# EAGLE design Bt_Drone (EAGLE 9.6.2)
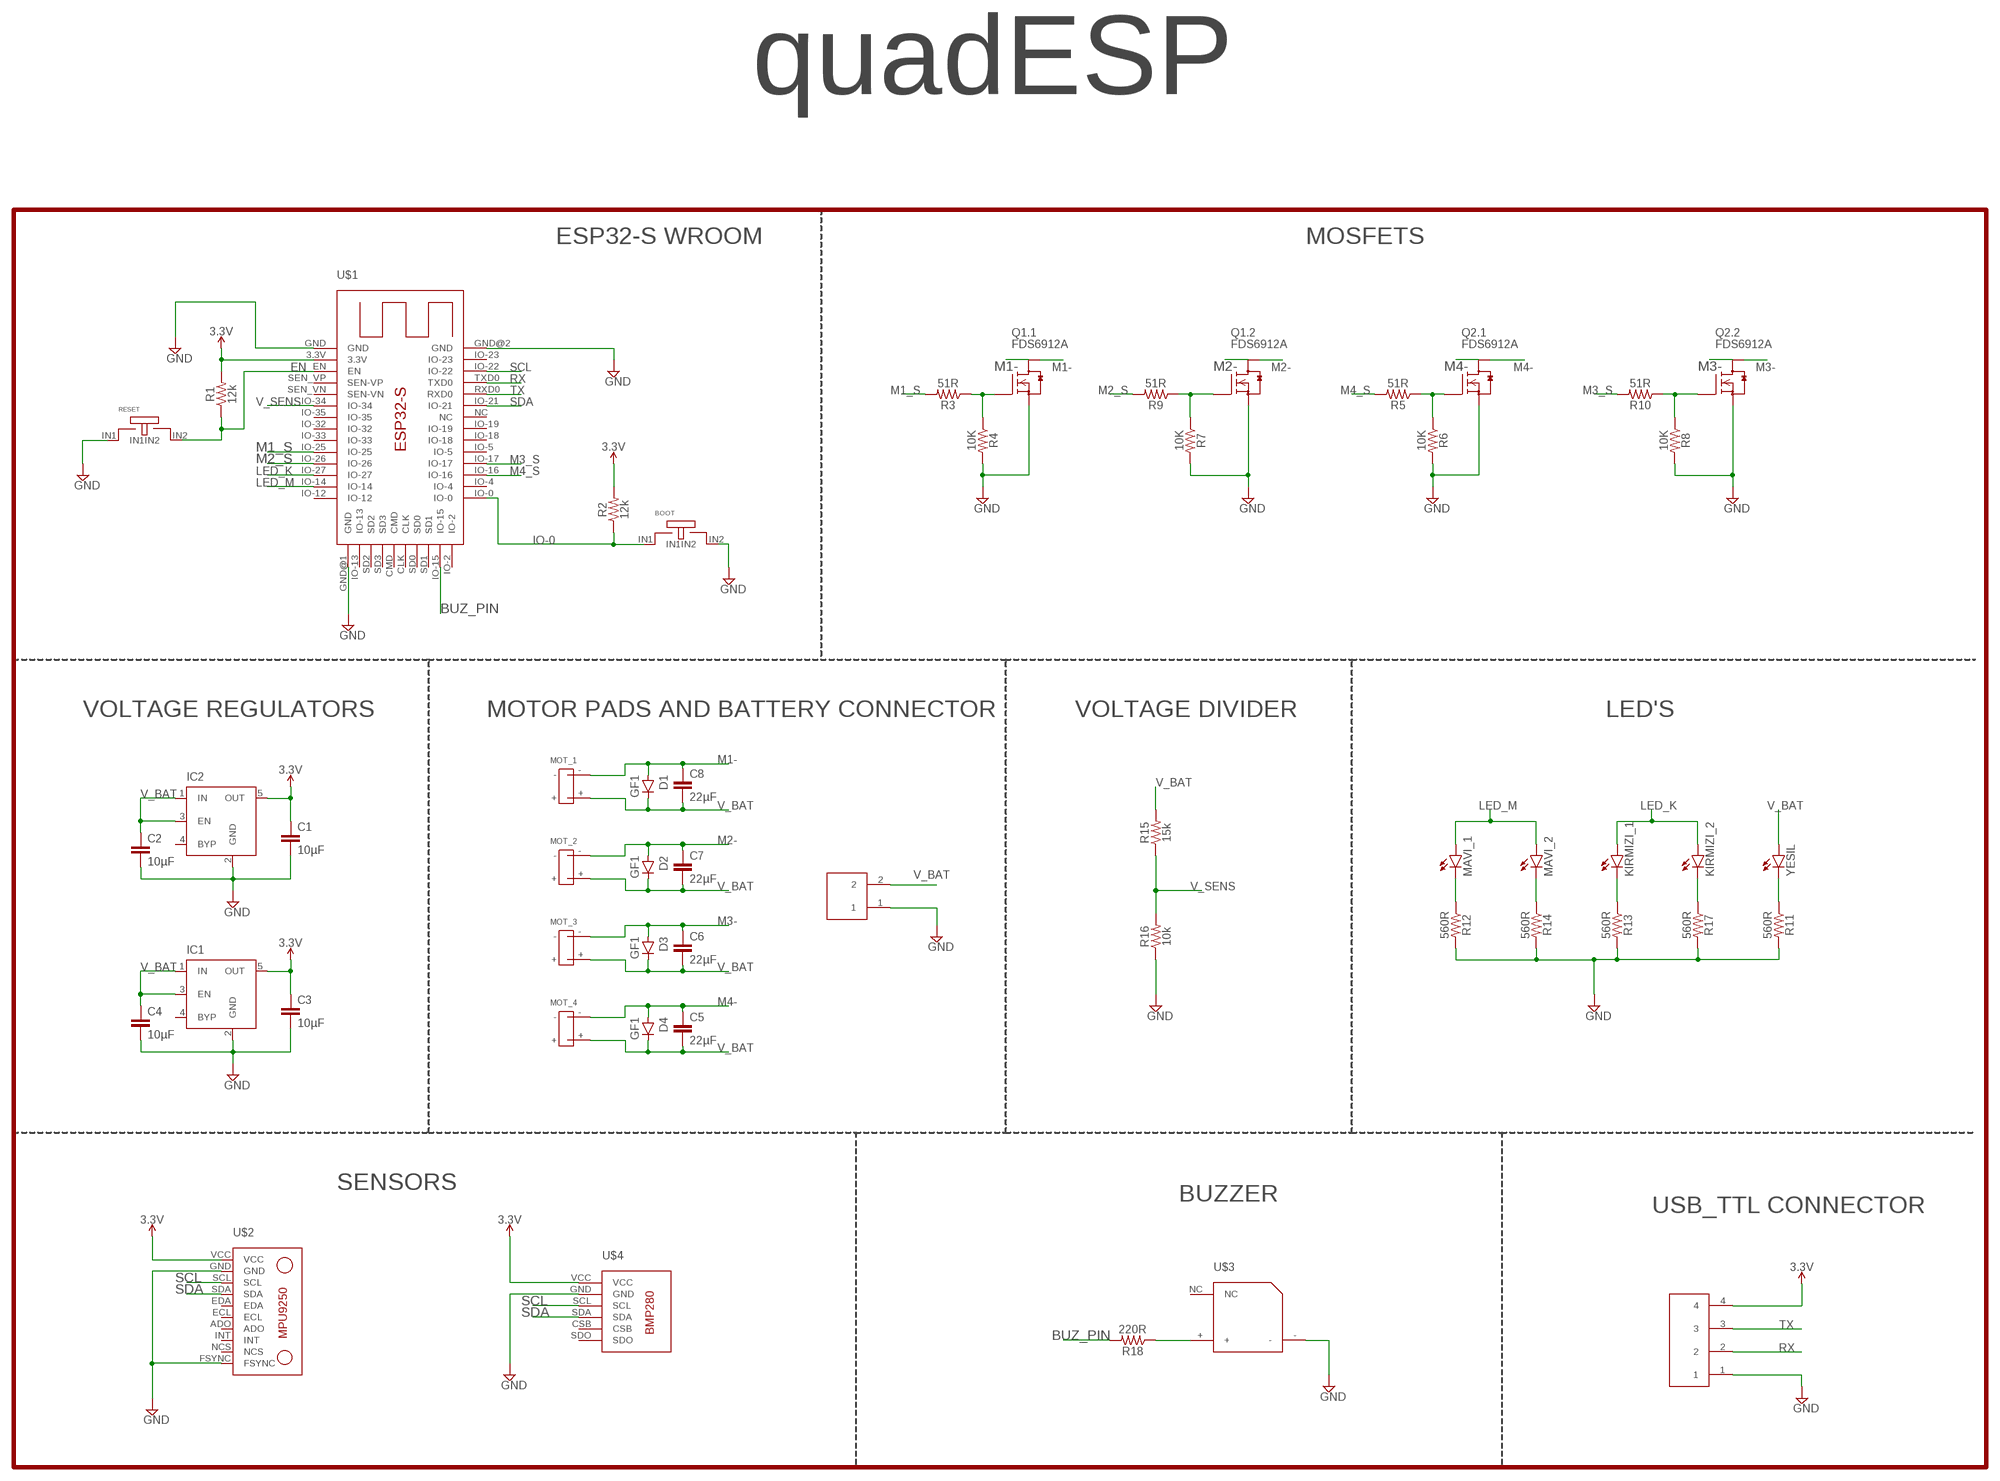
[diagram p0: schematic, sheet 1]

## Parts
BOOT  MINI_TIP_SMD_TACT_SWITCH_BUTON  [MINI_TIP_SMD_TACT_SWITCH_BUTON]
C1  10µF  0.33UF/330NF-0805-50V-10%  [0805]
C2  10µF  0.33UF/330NF-0805-50V-10%  [0805]
C3  10µF  0.33UF/330NF-0805-50V-10%  [0805]
C4  10µF  0.33UF/330NF-0805-50V-10%  [0805]
C5  22µF  0.33UF/330NF-0805-50V-10%  [0805]
C6  22µF  0.33UF/330NF-0805-50V-10%  [0805]
C7  22µF  0.33UF/330NF-0805-50V-10%  [0805]
C8  22µF  0.33UF/330NF-0805-50V-10%  [0805]
D1  GF1  [SMA-DO214AC]
D2  GF1  [SMA-DO214AC]
D3  GF1  [SMA-DO214AC]
D4  GF1  [SMA-DO214AC]
IC1  MIC5219XX  [SOT23-5]
IC2  MIC5219XX  [SOT23-5]
KIRMIZI_1  LEDCHIP-LED0805  [CHIP-LED0805]
KIRMIZI_2  LEDCHIP-LED0805  [CHIP-LED0805]
MAVI_1  LEDCHIP-LED0805  [CHIP-LED0805]
MAVI_2  LEDCHIP-LED0805  [CHIP-LED0805]
MOT_1  2X_SOLDER_PAD  [2X_SOLDER_PAD]
MOT_2  2X_SOLDER_PAD  [2X_SOLDER_PAD]
MOT_3  2X_SOLDER_PAD  [2X_SOLDER_PAD]
MOT_4  2X_SOLDER_PAD  [2X_SOLDER_PAD]
Q1  FDS6912A  [SO-8]
Q2  FDS6912A  [SO-8]
R1  12k  0.3OHM-0805-1/8W-1%  [0805]
R2  12k  0.3OHM-0805-1/8W-1%  [0805]
R3  51R  0.3OHM-0805-1/8W-1%  [0805]
R4  10K  0.3OHM-0805-1/8W-1%  [0805]
R5  51R  0.3OHM-0805-1/8W-1%  [0805]
R6  10K  0.3OHM-0805-1/8W-1%  [0805]
R7  10K  0.3OHM-0805-1/8W-1%  [0805]
R8  10K  0.3OHM-0805-1/8W-1%  [0805]
R9  51R  0.3OHM-0805-1/8W-1%  [0805]
R10  51R  0.3OHM-0805-1/8W-1%  [0805]
R11  560R  0.3OHM-0805-1/8W-1%  [0805]
R12  560R  0.3OHM-0805-1/8W-1%  [0805]
R13  560R  0.3OHM-0805-1/8W-1%  [0805]
R14  560R  0.3OHM-0805-1/8W-1%  [0805]
R15  15k  0.3OHM-0805-1/8W-1%  [0805]
R16  10k  0.3OHM-0805-1/8W-1%  [0805]
R17  560R  0.3OHM-0805-1/8W-1%  [0805]
R18  220R  0.3OHM-0805-1/8W-1%  [0805]
RESET  MINI_TIP_SMD_TACT_SWITCH_BUTON  [MINI_TIP_SMD_TACT_SWITCH_BUTON]
U$1  ESP32-S  [ESP32-S]
U$2  MPU9250  [MPU9250]
U$3  PASIVE_BUZZER_5MM_X_5MM_20MM  [PASIVE_BUZZER_5MM_X_5MM_20MM]
U$4  BMP280  [BMP280]
U$5  2_PIN_TUNIC  [2_PIN_TUNIC]
U$6  4_PIN_TUNIC  [4_PIN_TUNIC]
YESIL  LEDCHIP-LED0805  [CHIP-LED0805]

## Nets
3.3V: C1.1 C3.1 IC1.5(OUT) IC2.5(OUT) R1.2 R2.2 U$1.3.3V U$2.VCC U$4.VCC U$6.4
BUZ_PIN: R18.2 U$1.IO-15
EN: R1.1 RESET.IN2 U$1.EN
GND: BOOT.IN2 C1.2 C2.2 C3.2 C4.2 IC1.2(GND) IC2.2(GND) Q1.1(.2:S) Q1.3(.1:S) Q2.1(.2:S) Q2.3(.1:S) R4.2 R6.2 R7.2 R8.2 R11.2 R12.2 R13.2 R14.2 R16.1 R17.2 RESET.IN1 U$1.GND U$1.GND@1(GND) U$1.GND@2(GND) U$2.FSYNC U$2.GND U$3.- U$4.GND U$5.1 U$6.1
IO-0: BOOT.IN1 R2.1 U$1.IO-0
LED_K: KIRMIZI_1.A KIRMIZI_2.A U$1.IO-27
LED_M: MAVI_1.A MAVI_2.A U$1.IO-14
M1-: C8.1 D1.A MOT_1.- Q1.5(.1:D) Q1.6(.1:D)
M1_S: R3.2 U$1.IO-25
M2-: C7.1 D2.A MOT_2.- Q1.7(.2:D) Q1.8(.2:D)
M2_S: R9.2 U$1.IO-26
M3-: C6.1 D3.A MOT_3.- Q2.7(.2:D) Q2.8(.2:D)
M3_S: R10.2 U$1.IO-17
M4-: C5.1 D4.A MOT_4.- Q2.5(.1:D) Q2.6(.1:D)
M4_S: R5.2 U$1.IO-16
N$1: MAVI_2.C R14.1
N$2: KIRMIZI_1.C R13.1
N$3: KIRMIZI_2.C R17.1
N$4: R11.1 YESIL.C
N$5: MAVI_1.C R12.1
N$6: Q1.4(.1:G) R3.1 R4.1
N$7: Q1.2(.2:G) R7.1 R9.1
N$8: Q2.4(.1:G) R5.1 R6.1
N$9: Q2.2(.2:G) R8.1 R10.1
N$10: R18.1 U$3.+
RX: U$1.TXD0 U$6.2
SCL: U$1.IO-22 U$2.SCL U$4.SCL
SDA: U$1.IO-21 U$2.SDA U$4.SDA
TX: U$1.RXD0 U$6.3
V_BAT: C2.1 C4.1 C5.2 C6.2 C7.2 C8.2 D1.K(C) D2.K(C) D3.K(C) D4.K(C) IC1.1(IN) IC1.3(EN) IC2.1(IN) IC2.3(EN) MOT_1.+ MOT_2.+ MOT_3.+ MOT_4.+ R15.2 U$5.2 YESIL.A
V_SENS: R15.1 R16.2 U$1.IO-34
Unconnected: IC1.4(BYP) IC2.4(BYP) U$1.CLK U$1.CMD U$1.IO-2 U$1.IO-4 U$1.IO-5 U$1.IO-12 U$1.IO-13 U$1.IO-18 U$1.IO-19 U$1.IO-23 U$1.IO-32 U$1.IO-33 U$1.IO-35 U$1.NC U$1.SD0 U$1.SD1 U$1.SD2 U$1.SD3 U$1.SEN_VN(SEN-VN) U$1.SEN_VP(SEN-VP) U$2.ADO U$2.ECL U$2.EDA U$2.INT U$2.NCS U$3.NC U$4.CSB U$4.SDO

## Notes on the sheet
- quadESP
- ESP32-S WROOM | MOSFETS
- VOLTAGE REGULATORS | MOTOR PADS AND BATTERY CONNECTOR | VOLTAGE DIVIDER | LED'S
- SENSORS
- BUZZER
- USB_TTL CONNECTOR

## Library data of the parts
BOOT RESET = Tactile Switch 2 pin 6mm X 3mm:MINI_TIP_SMD_TACT_SWITCH_BUTON: 6 X 3mm smd switch
C1-C8 = SparkFun-Capacitors:0.33UF/330NF: 0.33µF/330nF ceramic capacitors A capacitor is a passive two-terminal electrical component used to store electrical energy temporarily in an electric field.; PROD_ID: CAP-08469; VALUE: 0.33µF
D1-D4 = diode:GF1: DIODE
IC1 IC2 = v-reg-micrel:MIC5219XX: VOLTAGE REGULATOR; OC_FARNELL: unknown; OC_NEWARK: unknown
KIRMIZI_1 KIRMIZI_2 MAVI_1 MAVI_2 YESIL = led:LED: LED OSRAM: - CHIPLED LG R971, LG N971, LY N971, LG Q971, LY Q971, LO R971, LY R971 LH N974, LH R974 LS Q976, LO Q976, LY Q976 LO Q996 - Hyper CHIPLED LW Q18S LB Q993, LB Q99A, LB R99A - SideLED LS A670, LO A670, LY A670, LG A670, LP A670 LB A673, LV A673, LT A673, LW A673 LH A674 LY A675 LS A676, LA A676, LO A676, LY A676, LW A676 LS A679, LY A679, LG A679 - Hyper Micro SIDELED® LS Y876, LA Y876, LO Y876, LY Y876 LT Y87S - SmartLED LW L88C, LW L88S LB L89C, LB L89S, LG L890 LS L89K, LO L89K, LY L89K LS L896, LA L896, LO L896, LY L896 - TOPLED LS T670, LO T670, LY T670, LG T670, LP T670 LSG T670, LSP T670, LSY T670, LOP T670, LYG T670 LG T671, LOG T671, LSG T671 LB T673, LV T673, LT T673, LW T673 LH T674 LS T676, LA T676, LO T676, LY T676, LB T676, LH T676, LSB T676, LW T676 LB T67C, LV T67C, LT T67C, LS T67K, LO T67K, LY T67K, LW E67C LS E67B, LA E67B, LO E67B, LY E67B, LB E67C, LV E67C, LT E67C LW T67C LS T679, LY T679, LG T679 LS T770, LO T770, LY T770, LG T770, LP T770 LB T773, LV T773, LT T773, LW T773 LH T774 LS E675, LA E675, LY E675, LS T675 LS T776, LA T776, LO T776, LY T776, LB T776 LHGB T686 LT T68C, LB T68C - Hyper Mini TOPLED® LB M676 - Mini TOPLED Santana® LG M470 LS M47K, LO M47K, LY M47K Source: http://www.osram.convergy.de LUXEON: - LUMILED® LXK2-PW12-R00, LXK2-PW12-S00, LXK2-PW14-U00, LXK2-PW14-V00 LXK2-PM12-R00, LXK2-PM12-S00, LXK2-PM14-U00 LXK2-PE12-Q00, LXK2-PE12-R00, LXK2-PE12-S00, LXK2-PE14-T00, LXK2-PE14-U00 LXK2-PB12-K00, LXK2-PB12-L00, LXK2-PB12-M00, LXK2-PB14-N00, LXK2-PB14-P00, LXK2-PB14-Q00 LXK2-PR12-L00, LXK2-PR12-M00, LXK2-PR14-Q00, LXK2-PR14-R00 LXK2-PD12-Q00, LXK2-PD12-R00, LXK2-PD12-S00 LXK2-PH12-R00, LXK2-PH12-S00 LXK2-PL12-P00, LXK2-PL12-Q00, LXK2-PL12-R00 Source: www.luxeon.com KINGBRIGHT: KA-3528ASYC Source: www.kingbright.com
MOT_1-MOT_4 = 2 X 3mm_round_solder_pads:2X_SOLDER_PAD
Q1 Q2 = m-pad-2.1:FDS6912A: Fairchild's FDS6912A Dual N-Channel Logic Level PowerTrench MOSFET General Description: These N-Channel Logic Level MOSFETs are produced using Fairchild Semiconductor's advanced PowerTrench process that has been especially tailored to minimize the on-state resistance and yet maintain superior switching performance. These devices are well suited for low voltage and battery powered applications where low in-line power loss and fast switching are required. Features: 6 A, 30 V. RDS(ON) = 28 mOhm @ VGS = 10 V RDS(ON) = 35 mOhm @ VGS = 4.5 V Fast switching speed Low gate charge High performance trench technology for extremely low RDS(ON) High power and current handling capability Please send any comments to: messi@users.sourceforge.net
R1-R18 = SparkFun-Resistors:0.3OHM: 0.3Ω resistor A resistor is a passive two-terminal electrical component that implements electrical resistance as a circuit element. Resistors act to reduce current flow, and, at the same time, act to lower voltage levels within circuits. - Wikipedia; PROD_ID: RES-11622; VALUE: 0.3
U$1 = ESP32-S:ESP32-S: ESP32-S WIFI/BLUETOOTH MICRO CONTROLLER IC size 18mm x 25.5mm pad size 1.5mm x 0.9mm
U$2 = MPU9250:MPU9250: MPU9250 9 DOF accelometer gyro compass sensor 15mm X 25mm
U$3 = PASIVE_BUZZER_5MM_X_5MM_20MM:PASIVE_BUZZER_5MM_X_5MM_20MM: PASIVE_BUZZER_5MM_X_5MM_20MM
U$4 = BMP280:BMP280: BMP280 Pressure sensor 11.5mm x 15mm
U$5 = Tunic_Connector:2_PIN_TUNIC
U$6 = Tunic_Connector:4_PIN_TUNIC

## Board
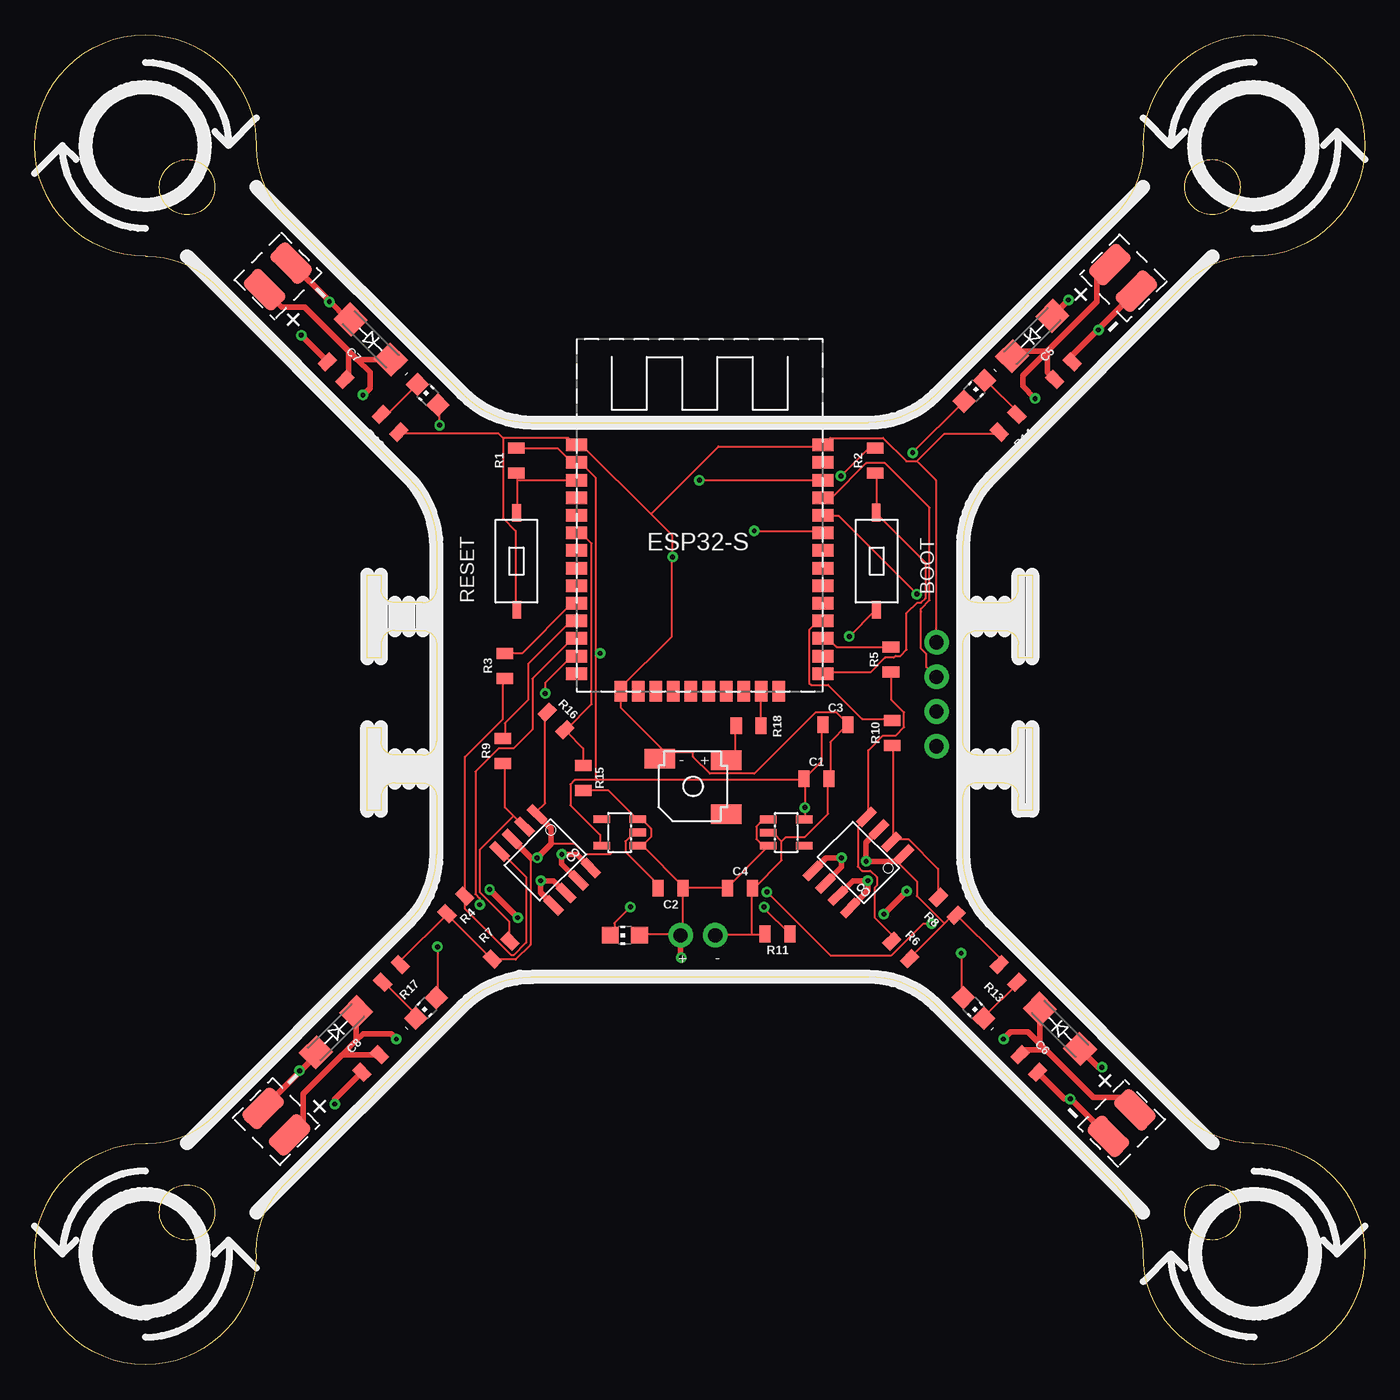
[diagram p1: board, top side]
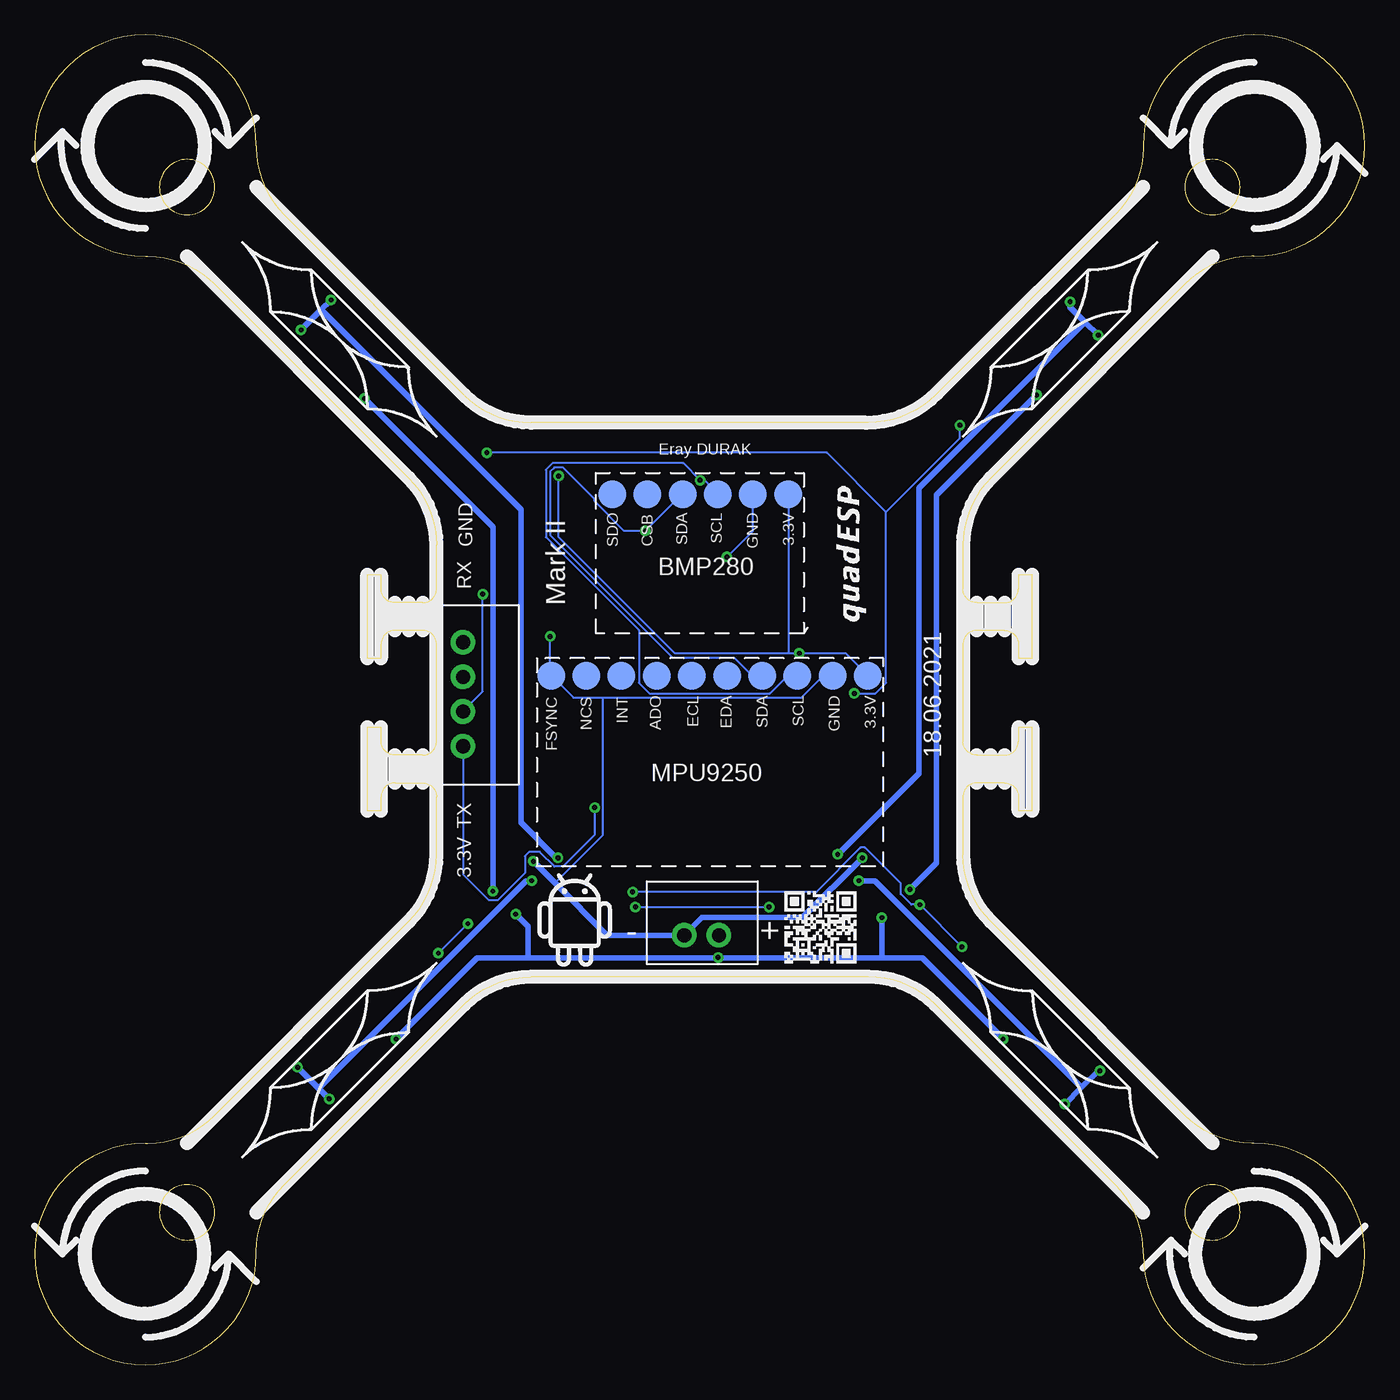
[diagram p2: board, bottom side, seen from below]

Size 96 x 96 mm. Coordinates in mm from the lower left corner, seen from the top.
Outline: 35.83,28 60.17,28 arc-45 65,26 78,13 arc-45 80,8.17 80,8 arc90 88,0 arc180 88,16 87.83,16 arc-45 83,18 69,32 arc-45 67,36.83 67,41 arc-90 68,42 70,42 arc-90 71,41 71,40 72,40 72,46 71,46 71,45 arc-90 70,44 68,44 arc-90 67,45 67,52 arc-90 68,53 70,53 arc-90 71,52 71,51 72,51 72,57 71,57 71,56 arc-90 70,55 68,55 arc-90 67,56 67,59.17 arc-45 69,64 83,78 arc-45 87.83,80 88,80 arc180 88,96 arc90 80,88 80,87.83 arc-45 78,83 65,70 arc-45 60.17,68 35.83,68 arc-45 31,70 18,83 arc-45 16,87.83 16,88 arc90 8,96 arc180 8,80 8.17,80 arc-45 13,78 27,64 arc-45 29,59.17 29,56 arc-90 28,55 26,55 arc-90 25,56 25,57 24,57 24,51 25,51 25,52 arc-90 26,53 28,53 arc-90 29,52 29,45 arc-90 28,44 26,44 arc-90 25,45 25,46 24,46 24,40 25,40 25,41 arc-90 26,42 28,42 arc-90 29,41 29,36.83 arc-45 27,32 13,18 arc-45 8.17,16 8,16 arc180 8,0 arc90 16,8 16,8.17 arc-45 18,13 31,26 arc-45 35.83,28
Outline: 83,85 arc-180 87,85 arc-180 83,85
Outline: 83,11 arc-180 87,11 arc-180 83,11
Outline: 9,11 arc-180 13,11 arc-180 9,11
Outline: 9,85 arc-180 13,85 arc-180 9,85
Copper layers (1*16): Top 0.035mm / dielectric 1.5mm / Bottom 0.035mm
Design rules "default": minimum track width 6mil, minimum drill 0.35mm, track to track 6mil, track to pad 6mil, pad to pad 6mil, via to via 6mil, smd to smd 6mil, copper to edge 40mil, drill to drill 6mil, minimum pad ring 10mil, minimum via ring 8mil, stop-mask expansion 4mil, vias tented up to drill 0mil, thermal gap 10mil
Holes 8.5 mm at 8,88 88,88 88,8 8,8

### Footprints (pad centres in the part's own frame; a part is rotated, then mirrored left to right if it is on the bottom)
MINI_TIP_SMD_TACT_SWITCH_BUTON = smd 1.27 x 0.635: IN1 -3.51,-0.53; IN2 3.5,-0.51
0805 = smd 0.8 x 1.2: 1 -0.9,0; 2 0.9,0
SMA-DO214AC = smd 1.8 x 1.7: A -2.05,0; K 2.05,0
SOT23-5 = smd 0.55 x 1.2: 1 -0.95,-1.3; 2 0,-1.3; 3 0.95,-1.3; 4 0.95,1.3; 5 -0.95,1.3
CHIP-LED0805 = smd 1.2 x 1.2: A 0,-1.05; C 0,1.05
2X_SOLDER_PAD = smd 3 x 1.7: + 0,-2; - 0,0.73
SO-8 = smd 1.524 x 0.61: 1 -2.743,1.27; 2 -2.743,0; 3 -2.743,-1.27; 4 -2.743,-2.54; 5 2.743,-2.54; 6 2.743,-1.27; 7 2.743,0; 8 2.743,1.27
ESP32-S = smd 1.5 x 0.9: 3.3V -8.89,7.62; EN -8.89,6.35; GND -8.89,8.89; GND@2 8.89,8.89; IO-0 8.89,-7.62; IO-4 8.89,-6.35; IO-5 8.89,-2.54; IO-12 -8.89,-7.62; IO-14 -8.89,-6.35; IO-16 8.89,-5.08; IO-17 8.89,-3.81; IO-18 8.89,-1.27; IO-19 8.89,0; IO-21 8.89,2.54; IO-22 8.89,6.35; IO-23 8.89,7.62; IO-25 -8.89,-2.54; IO-26 -8.89,-3.81; IO-27 -8.89,-5.08; IO-32 -8.89,0; IO-33 -8.89,-1.27; IO-34 -8.89,2.54; IO-35 -8.89,1.27; NC 8.89,1.27; RXD0 8.89,3.81; SEN_VN -8.89,3.81; SEN_VP -8.89,5.08; TXD0 8.89,5.08 | smd 0.9 x 1.5: CLK 0.635,-8.89; CMD -0.635,-8.89; GND@1 -5.715,-8.89; IO-2 5.715,-8.89; IO-13 -4.445,-8.89; IO-15 4.445,-8.89; SD0 1.905,-8.89; SD1 3.175,-8.89; SD2 -3.175,-8.89; SD3 -1.905,-8.89
MPU9250 = smd 2.032 x 2.032: ADO 1.27,8.89; ECL 1.27,11.43; EDA 1.27,13.97; FSYNC 1.27,1.27; GND 1.27,21.59; INT 1.27,6.35; NCS 1.27,3.81; SCL 1.27,19.05; SDA 1.27,16.51; VCC 1.27,24.13
PASIVE_BUZZER_5MM_X_5MM_20MM = smd 2.2 x 1.4: + -2.4,-1.9; - 2.4,-2; NC -2.4,2
BMP280 = smd 2.032 x 2.032: CSB -5.08,-2.54; GND -5.08,5.08; SCL -5.08,2.54; SDA -5.08,0; SDO -5.08,-5.08; VCC -5.08,7.62
2_PIN_TUNIC = drill 1.02 pad 1.778: 1 -1.3,0; 2 1.2,0
4_PIN_TUNIC = drill 1.02 pad 1.778: 1 -4,0; 2 -1.5,0; 3 1,0; 4 3.5,0

### Placement (x,y rotation side)
BOOT  61.27,58 270 top
C1  56.41,42.3 0 top
C2  45.9,34.4 180 top
C3  57.79,46.2 0 top
C4  50.9,34.4 0 top
C5  74.25,71.75 225 top
C6  71.75,21.75 135 top
C7  21.75,71.75 315 top
C8  24.25,21.75 45 top
D1  21.75,24 45 top
D2  24.25,74 315 top
D3  74,24.25 135 top
D4  72,74.25 225 top
IC1  54.24,38.41 270 top
IC2  42.22,38.42 90 top
KIRMIZI_1  67.76,25.76 225 top
KIRMIZI_2  28.24,25.76 135 top
MAVI_1  28.37,70.02 45 top
MAVI_2  67.82,70.29 315 top
MOT_1  17,18 45 top
MOT_2  18,79 315 top
MOT_3  78,17 135 top
MOT_4  79,78 225 top
Q1  37.3,36.9 315 top
Q2  59.9,35.8 225 top
R1  34.75,65.25 90 top
R2  60.65,65.25 90 top
R3  33.93,50.44 90 top
R4  30.4,33.2 225 top
R5  61.8,50.9 90 top
R6  62.5,29.94 315 top
R7  33.67,29.93 225 top
R8  65.86,33.1 315 top
R9  33.8,44.3 90 top
R10  61.9,45.6 90 top
R11  53.6,31.1 180 top
R12  25.65,67.95 315 top
R13  70.25,28.25 135 top
R14  70.25,67.95 225 top
R15  39.6,42.36 270 top
R16  37.63,46.47 315 top
R17  25.75,28.25 45 top
R18  51.53,46.13 0 top
RESET  34.27,58 90 top
U$1  48,57.5 0 top
U$2  60,51 270 bottom
U$3  47.52,41.75 180 top
U$4  49.24,57.75 270 bottom
U$5  47.82,31.01 180 top
U$6  65.09,48.15 270 top
YESIL  42.6,31 90 top

### Tracks (layer width: path | path; a pad name or v marks a point on that pad's centre or on a via)
3.3V  (via drill 0.35)
  Top 0.152: v58.18,64.15 60.16,66.13 60.62,66.13 R2.2 | R1.2 34.86,66.13 37.76,66.13 38.67,65.22 38.98,65.22 U$1.3.3V 39.13,65.07 39.44,65.07 40.5,64 40.5,51.35 | 40.5,42.21 55.44,42.21 C1.1 | 40.5,42.21 38.98,42.21 38.67,41.9 38.67,40.38 40.81,38.24 40.81,37.48 IC2.5 | IC1.5 55.59,39.46 v55.59,40.23 55.59,42.21 C1.1 | C3.1 56.81,46.17 56.81,43.58 55.59,42.36 C1.1 | 40.5,42.21 40.5,51.35 | 40.5,51.35 v40.81,51.35
  Bottom 0.152: v58.18,64.15 58.18,59.73 49.8,51.35 41.57,51.35 | 41.57,51.35 v40.81,51.35 37.45,51.35 35.93,49.83 U$2.VCC | 41.57,51.35 41.57,62.78 U$4.VCC | v55.59,40.23 55.59,38.24 57.88,35.96 58.49,35.96 59.55,37.02 60.31,37.02 60.62,36.72 60.62,35.5 62.6,33.52 63.21,33.52 65.04,35.35 65.04,44.65 U$6.4
BUZ_PIN
  Top 0.152: R18.2 52.39,46.17 52.39,48.61 U$1.IO-15
EN
  Top 0.152: 34.86,63.85 34.86,61.56 RESET.IN2 | 34.86,63.85 34.86,64.3 R1.1 | 34.86,63.85 38.98,63.85 U$1.EN
GND  (via drill 0.35)
  Top 0.152: 63.67,65.22 65.65,67.2 69.61,67.2 R14.2 | 63.67,65.22 62.91,65.22 61.23,66.89 57.42,66.89 56.96,66.44 U$1.GND@2 56.81,66.29 49.34,66.29 44.47,61.41 | 63.67,65.22 65.04,63.85 65.04,52.27 U$6.1 | 33.8,66.89 33.49,67.2 26.33,67.2 R12.2 | 33.8,66.89 38.52,66.89 38.98,66.44 U$1.GND 39.13,66.29 39.59,66.29 44.47,61.41 | 33.8,66.89 33.8,61.1 34.71,60.19 34.71,54.55 RESET.IN1 | 44.47,61.41 45.99,59.89 45.99,58.36 v46.04,58.31 45.99,58.21 45.99,52.57 42.18,48.76 U$1.GND@1 42.33,48.61 42.33,47.39 45.53,44.19 U$3.- 45.58,44.21 47.44,44.21 47.51,44.19 47.51,43.88 48.73,42.66 51.93,42.66 56.35,47.08 57.88,47.08 58.64,46.32 C3.2 58.64,46.17 57.42,44.95 57.42,42.36 C1.2 57.27,42.21 57.27,39.77 55.59,38.09 54.22,38.09 53.91,37.79 | v58.79,52.57 60.62,54.4 BOOT.IN2 | R17.2 26.48,28.95 26.48,29.25 29.68,32.45 R4.2 29.84,32.45 32.88,29.41 R7.2 33.03,29.25 34.71,29.25 35.78,30.32 35.78,36.41 35.81,36.59 | 65.65,31.84 66.41,32.6 R8.2 66.56,32.45 69.61,29.41 69.61,28.95 R13.2 | 65.65,31.84 63.21,29.41 R6.2 | 42.64,37.02 44.92,34.74 44.92,34.43 C2.2 | 42.64,37.02 42.64,37.79 43.4,38.55 IC2.2 | R16.1 36.84,47.08 36.84,40.53 36.24,39.92 Q1.1 | 51.78,31.08 49.19,31.08 U$5.1 | 51.78,31.08 52.69,31.08 R11.2 | 51.78,31.08 51.78,34.28 C4.2 51.93,34.43 53.91,36.41 53.91,37.79 | 53.91,37.79 53.3,38.4 53,38.4 IC1.2 | 42.64,37.02 41.72,37.02 41.57,36.87 39.74,36.87 38.98,37.63 37.45,37.63 37.28,37.61 | 65.65,31.84 63.67,33.82 63.67,34.89 62.3,36.26 Q2.1
  Top 0.406: Q2.1 62.23,36.34 v60.01,36.34 60.01,37.71 Q2.3 | Q1.3 35.81,36.59 v36.26,36.59 37.28,37.61 37.28,38.72 Q1.1
  Bottom 0.152: v46.04,58.31 44.16,60.19 U$4.GND | v58.79,52.57 58.79,49.83 U$2.FSYNC 58.64,49.67 57.11,48.15 54.98,48.15 | 54.98,48.15 40.66,48.15 39.13,49.67 38.52,49.67 U$2.GND | 54.98,48.15 54.98,38.24 58.45,34.78
  Bottom 0.406: v60.01,36.34 58.45,34.78 54.68,31.01 U$5.1 47.85,32.27 40.58,32.27 v36.26,36.59
IO-0
  Top 0.152: R2.1 60.77,64.3 60.77,61.56 BOOT.IN1 60.77,61.41 64.28,57.9 64.28,55.31 63.97,55.01 63.69,55.01 62.93,54.25 62.93,51.61 62.5,51.17 62.13,51.17 62,51.05 61.38,51.05 60.31,49.98 56.96,49.98 U$1.IO-0
LED_K  (via drill 0.35)
  Top 0.152: v29.07,30.17 29.07,26.51 KIRMIZI_2.A | v32.12,33.22 32.12,33.67 31.82,33.98 31.82,42.82 33.49,44.49 34.56,44.49 35.93,45.86 35.93,49.52 38.98,52.57 U$1.IO-27 | v66.87,29.71 66.87,26.51 KIRMIZI_1.A | v64.73,31.84 64.12,31.84 61.84,29.56 57.42,29.56 v52.85,34.13
  Bottom 0.152: v29.07,30.17 v32.12,33.22 32.73,33.22 33.49,33.98 33.49,34.74 36.08,37.33 36.39,37.33 39.59,34.13 v52.85,34.13 | v64.73,31.84 v66.87,29.71
LED_M  (via drill 0.35)
  Top 0.152: v29.23,67.81 29.23,69.18 MAVI_1.A | v36.84,48.45 36.84,49.22 38.67,51.05 38.98,51.05 U$1.IO-14 | v63.36,65.83 67.02,69.49 MAVI_2.A
  Bottom 0.152: v29.23,67.81 29.23,66.89 34.56,61.56 | 34.56,61.56 34.56,49.22 35.32,48.45 v36.84,48.45 | v63.36,65.83 38.83,65.83 34.56,61.56
M1-  (via drill 0.35)
  Top 0.406: MOT_1.- 19.12,21.15 | 19.12,21.15 v19.12,21.23 | v21.66,18.81 21.66,19.16 C8.1 | Q1.5 36.52,34.09 v36.52,34.94 37.46,34.94 Q1.6 | D1.A 20.3,22.33 19.12,21.15
  Bottom 0.406: v19.12,21.23 19.24,21.23 20.45,20.02 | 20.45,20.02 v21.66,18.81 | 20.45,20.02 35.37,34.94 v36.52,34.94
M1_S
  Top 0.152: R3.2 33.95,51.35 35.17,51.35 38.67,54.86 38.98,54.86 U$1.IO-25
M2-  (via drill 0.35)
  Top 0.406: MOT_2.- 21.27,76.76 | 21.27,76.76 v21.27,76.72 | v19.24,74.31 21.11,72.44 C7.1 | D2.A 22.58,75.45 21.27,76.76 | Q1.7 38.04,36.16 v38.04,36.85 39.15,36.85 Q1.8
  Bottom 0.406: v21.27,76.72 21.27,76.34 20.2,75.26 | 20.2,75.26 v19.24,74.31 | 20.2,75.26 32.2,63.26 32.2,42.69 v38.04,36.85
M2_S
  Top 0.152: R9.2 33.95,45.25 33.95,46.32 35.63,48 35.63,50.59 38.67,53.64 38.98,53.64 U$1.IO-26
M3-  (via drill 0.35)
  Top 0.406: MOT_3.- 74.77,19.19 v74.74,19.19 74.31,19.19 C6.1 | v77.03,21.48 76.77,21.48 D3.A | Q2.8 60.14,34.24 v60.14,34.94 59.04,34.94 Q2.7
  Bottom 0.406: v74.74,19.19 75.5,19.96 | 75.5,19.96 v77.03,21.48 | 75.5,19.96 60.52,34.94 v60.14,34.94
M3_S
  Top 0.152: R10.2 61.84,46.63 59.7,46.63 57.27,49.06 56.05,49.06 55.89,49.22 55.89,53.03 56.5,53.64 56.81,53.64 U$1.IO-17
M4-  (via drill 0.35)
  Top 0.406: MOT_4.- 76.77,74.74 | 76.77,74.74 v76.77,74.69 | v74.61,76.85 73.46,75.7 D4.A | C5.1 74.89,72.85 76.77,74.74 | Q2.6 58.23,35.93 v58.23,36.59 57.1,36.59 Q2.5
  Bottom 0.406: v76.77,74.69 75.31,76.15 | 75.31,76.15 v74.61,76.85 | 75.31,76.15 60.9,61.74 60.9,39.13 58.36,36.59 v58.23,36.59
M4_S
  Top 0.152: R5.2 61.69,51.81 57.88,51.81 57.27,52.42 56.96,52.42 U$1.IO-16
N$1
  Top 0.152: MAVI_2.C 68.7,71.01 70.98,68.72 R14.1
N$2
  Top 0.152: KIRMIZI_1.C 68.54,25.14 70.98,27.58 R13.1
N$3
  Top 0.152: KIRMIZI_2.C 27.4,25.14 27.4,25.44 25.26,27.58 R17.1
N$4  (via drill 0.35)
  Top 0.152: YESIL.C 41.57,30.93 41.85,30.93 41.85,31.89 v42.99,33.04 | R11.1 52.64,32.96 v52.64,33.04
  Bottom 0.152: v52.64,33.04 v42.99,33.04
N$5
  Top 0.152: R12.1 25.11,68.72 25.57,68.72 27.55,70.7 MAVI_1.C
N$6
  Top 0.152: Q1.4 33.65,37.02 35.47,35.2 35.47,30.47 34.56,29.56 34.41,29.56 31.05,32.91 31.05,33.82 R4.1 31.05,33.98 31.05,43.88 33.8,46.63 33.8,49.52 R3.1
N$7
  Top 0.152: 34.56,39.62 35.32,38.85 Q1.2 | 34.56,39.62 33.95,40.23 33.95,43.27 R9.1 | 34.56,39.62 32.12,37.18 32.12,34.13 34.25,32 34.25,30.62 R7.1
N$8
  Top 0.152: R5.1 61.84,49.98 61.84,48 62.75,47.08 62.75,46.02 62.14,45.41 61.23,45.41 60.16,44.34 60.16,39.62 Q2.4 60.01,39.46 59.4,38.85 59.4,35.96 59.7,35.65 60.31,35.65 60.77,35.2 60.77,34.59 60.62,34.43 60.62,32.3 61.84,31.08 61.84,30.62 R6.1
N$9
  Top 0.152: 61.99,37.94 61.99,37.79 Q2.2 61.99,37.94 | 61.99,37.94 61.99,44.65 R10.1 | 61.99,37.94 63.06,37.94 65.19,35.81 65.19,33.82 R8.1
N$10
  Top 0.152: R18.1 50.56,46.02 50.56,44.34 49.95,43.73 U$3.+
RX
  Top 0.152: U$1.TXD0 56.96,62.63 57.57,62.63 60.01,65.07 61.38,65.07 64.58,61.87 64.58,55.19 63.95,54.55 63.95,54.37 63.97,54.35 63.97,51.69 64.36,51.3 64.36,50.36 65.04,49.67 U$6.2
SCL  (via drill 0.35)
  Top 0.152: v47.97,63.85 56.81,63.85 U$1.IO-22
  Bottom 0.152: U$4.SCL 46.75,62.93 47.67,63.85 v47.97,63.85 49.19,65.07 58.64,65.07 59.1,64.61 59.1,59.73 52.39,53.03 52.39,49.22 51.63,48.45 42.94,48.45 41.72,49.67 40.96,49.67 U$2.SCL
SDA  (via drill 0.35)
  Top 0.152: v51.93,60.19 56.81,60.19 U$1.IO-21
  Bottom 0.152: U$4.SDA 49.34,62.78 v51.93,60.19 53.46,60.19 55.59,62.32 55.59,62.48 57.88,64.76 58.49,64.76 58.79,64.46 58.79,59.89 49.95,51.05 45.53,51.05 44.31,49.83 43.55,49.83 U$2.SDA
TX  (via drill 0.35)
  Top 0.152: v63.67,55.62 58.03,61.26 56.96,61.26 U$1.RXD0
  Bottom 0.152: v63.67,55.62 63.67,48.61 65.04,47.24 U$6.3
V_BAT  (via drill 0.35)
  Top 0.152: 43.86,37.48 43.55,37.48 IC2.1 43.86,37.48 | 43.86,37.48 44.47,38.09 44.47,38.7 43.86,39.31 43.55,39.31 IC2.3 43.4,39.46 41.42,41.44 39.74,41.44 R15.2 | YESIL.A 43.7,31.08 46.45,31.08 U$5.2 46.75,31.08 46.75,34.28 C2.1 46.9,34.43 | IC1.1 52.85,39.31 52.54,39.31 52.08,38.85 52.08,37.94 52.54,37.48 52.85,37.48 IC1.3 52.85,37.33 49.95,34.43 | 49.95,34.43 46.9,34.43 | 49.95,34.43 C4.1 | 46.9,34.43 43.86,37.48
  Top 0.406: MOT_1.+ 19.37,17.54 19.37,19.57 22.18,22.39 | 22.18,22.39 C8.2 | D1.K 23.2,23.41 | 22.18,22.39 23.2,23.41 | 23.2,23.41 23.69,23.89 25.72,23.89 v26.1,23.51 | MOT_3.+ 78.51,19.32 76.39,19.32 72.96,22.75 | 72.96,22.75 71.48,22.75 C6.2 | D3.K 72.55,23.16 | 72.55,23.16 72.96,22.75 | 72.55,23.16 71.69,24.02 70.42,24.02 v69.92,23.51 | MOT_2.+ 17.83,76.34 19.5,76.34 22.67,73.17 | 22.67,73.17 22.67,71.4 C7.2 | D2.K 23.29,72.55 | 23.29,72.55 22.67,73.17 | 23.29,72.55 24.2,71.64 24.2,70.5 v23.69,69.99 | MOT_4.+ 76.65,78.47 76.65,76.72 73.09,73.17 | 73.09,73.17 73.09,71.64 C5.2 | D4.K 70.92,73.17 73.09,73.17 | 73.09,73.17 71.31,71.39 71.31,70.63 v72.2,69.74 | v62.93,34.18 v61.28,32.53 | v32.83,34.31 v34.86,32.27 | U$5.2 46.62,29.45 v46.67,29.39
  Bottom 0.406: v26.1,23.51 31.94,29.35 34.86,29.35 | 34.86,29.35 46.67,29.35 | 46.67,29.35 v46.67,29.39 | v69.92,23.51 64.07,29.35 60.39,29.35 | 60.39,29.35 46.67,29.35 | v72.2,69.74 62.93,60.47 v62.93,34.18 | v61.28,32.53 60.39,31.64 60.39,29.35 | v23.69,69.99 30.93,62.75 30.93,36.21 v32.83,34.31 | v34.86,32.27 34.86,29.35
V_SENS
  Top 0.152: R15.1 39.59,43.27 39.59,44.49 38.37,45.71 R16.2 38.37,45.86 40.2,47.69 40.2,59.28 39.44,60.04 39.13,60.04 U$1.IO-34

### Text on the board
tPlace: - | - | RESET | BOOT | - | + | + | - | - | -
bPlace: Eray DURAK | 3.3V | GND | SCL | SDA | CSB | SDO | Mark II | GND | RX | 18.06.2021 | 3.3V | GND | SCL | SDA | EDA | ECL | ADO | INT | NCS | FSYNC | TX | 3.3V | + | -